# EAGLE schematic FrontEnd (EAGLE 7.1.0)
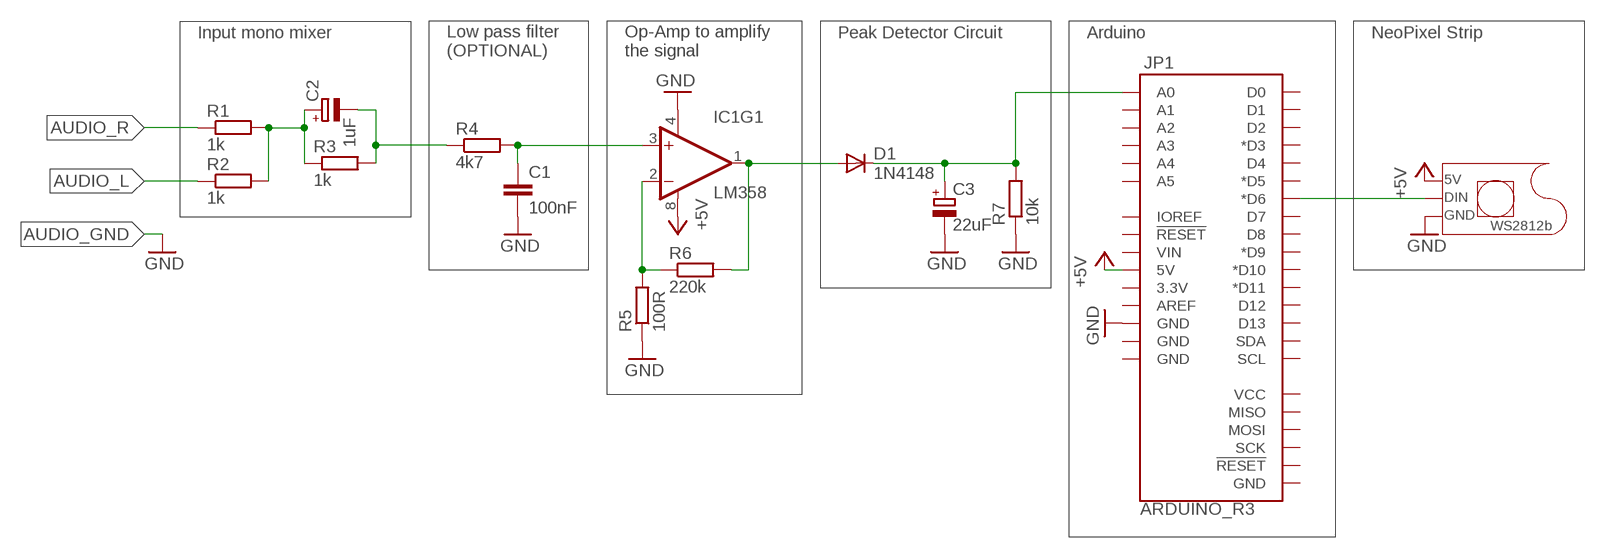
[diagram p0: schematic, sheet 1]

## Parts
C1  100nF  C-EU025-024X044  [C025-024X044]
C2  1uF  CPOL-EU085CS-1AR  [085CS_1AR]
C3  22uF  CPOL-EU085CS-1AR  [085CS_1AR]
D1  1N4148  1N4148DO35-10  [DO35-10]
IC1  LM358  [DIP08]
JP1  ARDUINO_R3  [ARDUINO_R3]
R1  1k  R-EU_0204/2V  [0204V]
R2  1k  R-EU_0204/2V  [0204V]
R3  1k  R-EU_0204/2V  [0204V]
R4  4k7  R-EU_0204/5  [0204/5]
R5  100R  R-EU_0204/2V  [0204V]
R6  220k  R-EU_0204/2V  [0204V]
R7  10k  R-EU_0204/2V  [0204V]

## Nets
+5V: IC1.8(V+) JP1.5V
AUDIO_L: R2.1
AUDIO_R: R1.1
GND: C1.2 C3.- IC1.4(V-) JP1.GND@4(GND) R5.1 R7.1
N$1: JP1.D6(*D6)
N$2: C2.- R3.2 R4.1
N$3: C1.1 IC1.3(+IN) R4.2
N$4: IC1.2(-IN) R5.2 R6.1
N$5: C2.+ R1.2 R2.2 R3.1
N$6: D1.A IC1.1(OUT) R6.2
N$7: C3.+ D1.C JP1.A0 R7.2
Unconnected: IC1.5(+IN) IC1.6(-IN) IC1.7(OUT) JP1.3.3V JP1.A1 JP1.A2 JP1.A3 JP1.A4 JP1.A5 JP1.AREF JP1.D0 JP1.D1 JP1.D2 JP1.D3(*D3) JP1.D4 JP1.D5(*D5) JP1.D7 JP1.D8 JP1.D9(*D9) JP1.D10(*D10) JP1.D11(*D11) JP1.D12 JP1.D13 JP1.GND@1(GND) JP1.GND@2(GND) JP1.GND@3(GND) JP1.IOREF JP1.MISO JP1.MOSI JP1.RESET@1(!RESET!) JP1.RESET@2(!RESET!) JP1.SCK JP1.SCL JP1.SDA JP1.VCC JP1.VIN

## Notes on the sheet
- Input mono mixer | Peak Detector Circuit | Arduino | NeoPixel Strip
- Low pass filter
  (OPTIONAL)
- Op-Amp to amplify
  the signal
- 5V
- DIN
- GND
- WS2812b

## Library data of the parts
C1 = rcl:C-EU: CAPACITOR, European symbol
C2 C3 = rcl:CPOL-EU: POLARIZED CAPACITOR, European symbol
D1 = diode:1N4148: DIODE high speed (Philips)
IC1 = SparkFun-AnalogIC:LM358: Jellybean op-amp; PROD_ID: IC-09172
JP1 = SparkFun-Boards:ARDUINO_R3: Arduino R3 Footprint (w/ SPI header)
R1-R7 = rcl:R-EU_: RESISTOR, European symbol